# Altium schematic sheet Power.SchDoc
size A
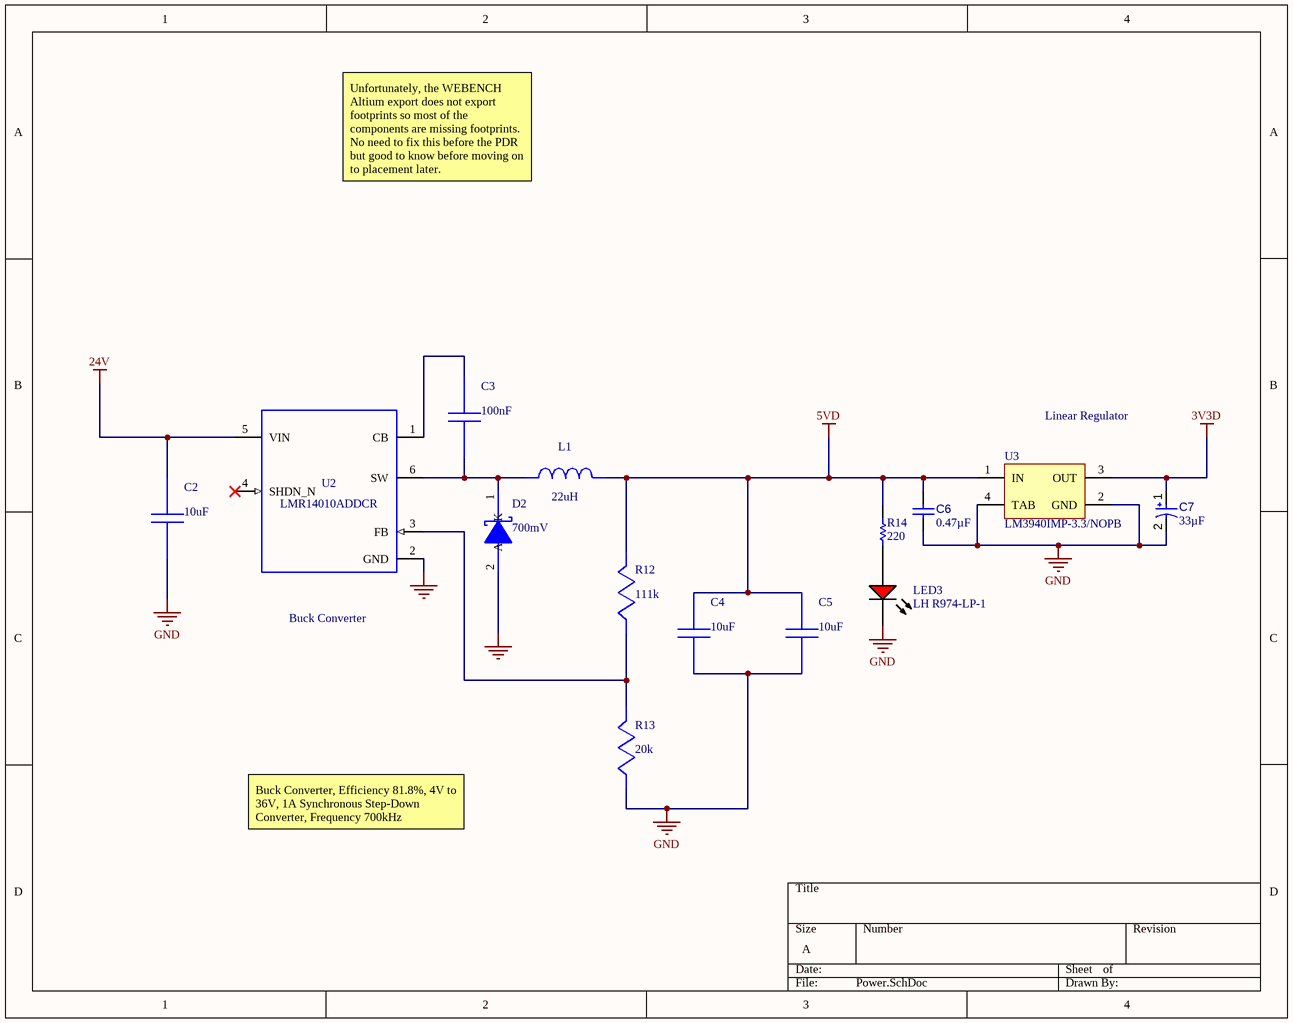
[diagram p0: Power.SchDoc]

## Parts
C2  value 10uF  (hidden comment: C3225X7R1H106M250AC)
C3  value 100nF  (hidden comment: C0805C104M5RACTU)
C4  value 10uF  (hidden comment: C3216X6S1V106K160AC)
C5  value 10uF  (hidden comment: C3216X6S1V106K160AC)
C6  0.47µF  [CAPC2013X145X50ML20T25]
C7  value 33µF  [KEMT-T491-D_M]  (hidden comment: T491D107K010AT)
D2  value 700mV  (hidden comment: SS26FL)
L1  value 22uH  (hidden comment: NPI105C220MTRF)
LED3  LH R974-LP-1  [0805_A]
R12  value 111k  (hidden comment: RT0805BRD07111KL)
R13  value 20k  (hidden comment: CRCW040220K0FKED)
R14  220  [RESC2013X50X35ML15T15]
U2  LMR14010ADDCR
U3  LM3940IMP-3.3/NOPB  [DCY0004A_M]

## Nets
0: D2.2(A) U2.2(GND)
3V3D: C7.1 U3.3(OUT)
5VD: C4.1 C5.1 C6.1 L1.2 R12.1 R14.1 U3.1(IN)
24V: C2.1 U2.5(VIN)
GND: C2.2 C4.2 C5.2 C6.2 C7.2 LED3.1(K) R13.2 U3.2(GND) U3.4(TAB)
NetC3_1: C3.1 U2.1(CB)
NetC3_2: C3.2 D2.1(K) L1.1 U2.6(SW)
NetLED3_2: LED3.2(A) R14.2
NetR12_2: R12.2 R13.1 U2.3(FB)

Not connected (* = marked no-connect by the designer): U2 4(SHDN_N)*

## Notes on the sheet
- Unfortunately, the WEBENCH Altium export does not export footprints so most of the components are missing footprints. No need to fix this before the PDR but good to know before moving on to placement later.
- Linear Regulator
- Buck Converter
- Buck Converter, Efficiency 81.8%, 4V to 36V, 1A Synchronous Step-Down Converter, Frequency 700kHz

## Library data of the parts
C2 = C3225X7R1H106M250AC: C3225X7R1H106M25; Manufacturer Name: TDK; PackageReference: C3225X7R1H106M250AC; Manufacturer Part Number: C3225X7R1H106M250AC
C3 = C0805C104M5RACTU: Manufacturer Name: Kemet; PackageReference: C0805C104M5RACTU; Manufacturer Part Number: C0805C104M5RACTU
C4 C5 = C3216X6S1V106K160AC: C3216X6S1V106K16; Manufacturer Name: TDK; PackageReference: C3216X6S1V106K160AC; Manufacturer Part Number: C3216X6S1V106K160AC
C6 = CMP-001-00010-4: Chip Capacitor, 1 uF, +/-10%, 25 V, 0805 (2012 Metric); Tolerance: 10%; Capacitor Type: Ceramic; Voltage Rating: 25V; Mounting Technology: SM; Case/Package: 0805; Max Operating Temperature: 125°C; RoHS Compliant: True; Value: 0.47µF; Min Operating Temperature: -55°C; Pins: 2
C7 = CMP-001-00037-5: Tantalum Surface Mount Capacitor-Standard Tantalum, 100 uF, +/- 10%, 10 V, -55 to 125 degC, 2917 (7343 Metric), RoHS, Tape and Reel; Manufacturer: Kemet; Ripple Current: 463mA; Voltage Rating: 10V; ESR: 700mohm; Manufacturer URL: http://www.kemet.com/; Case/Package: 2917; Tolerance: 10%; Datasheet URL: http://www.kemet.com/Lists/ProductCatalog/Attachments/254/KEM_T2005_T491.pdf; Packaging: TapeandReel; Pins: 2; Package Reference: T491-D; Package Description: 2-Pin Surface Mount Device, Body 7.3 x 4.3 mm; Min Operating Temperature: -55°C; Datasheet Version: Jun-16; Mounting Technology: SM; Package Quantity: 1; Capacitor Type: Tantalum; Max Operating Temperature: 125°C; RoHS Compliant: True
D2 = SS26FL: Manufacturer Name: Fairchild Semiconductor; PackageReference: SS26FL; Manufacturer Part Number: SS26FL
L1 = NPI105C220MTRF: Manufacturer Name: NIC Components; PackageReference: NPI105C220MTRF; Manufacturer Part Number: NPI105C220MTRF
LED3 = CMP-62016-000032-1: LED RED DIFFUSED 0805 SMD; Number of Elements: 1; Forward Voltage: 2.6V; Viewing Angle: 160°; Reverse Voltage: 5V; Test Current: 20mA; Dominant Wavelength: 645nm; Forward Current: 30mA; Luminous Intensity: 15mcd; Depth: 1.35mm; Min Operating Temperature: -30°C; Length: 2.1mm; Max Operating Temperature: 85°C; Radiation Hardening: No; Packaging: Tape and Reel; Number of Pins: 2; Mount: Surface Mount; Lens Style: Diffused
R12 = RT0805BRD07111KL: Manufacturer Name: Yageo; PackageReference: RT0805BRD07111KL; Manufacturer Part Number: RT0805BRD07111KL
R13 = CRCW040220K0FKED: Manufacturer Name: Vishay-Dale; PackageReference: CRCW040220K0FKED; Manufacturer Part Number: CRCW040220K0FKED
R14 = CMP-009-00001-4: Chip Resistor, 10k Ohm, +/- 1%, 125 mW, -55 to 155 degC, 0805 (2012 Metric); Value: 220
U2 = LMR14010ADDCR: Manufacturer Name: Texas Instruments; PackageReference: LMR14010ADDCR; Manufacturer Part Number: LMR14010ADDCR; Value: N/A
U3 = CMP-0062-01788-3: 1A Low Dropout Regulator for 5V to 3.3V Conversion, 4-pin SOT-223, Pb-Free; Manufacturer: Texas Instruments; PowerWise: N; CompType: LDO IC; PackageTopMarking: XYTT*L52B; PackageDescription: Molded SOT-223, 6.50 x 3.56 x 1.6mm Body, 4 Lead, 2.3mm Pitch; ComponentLink1URL: http://www.ti.com/general/docs/lit/getliterature.tsp?genericPartNumber=LM3940&fileType=pdf; PackageReference: DCY0004A; RoHS: Y; ComponentLink1Description: Datasheet URL; PinCount: 4; Code_JEDEC: TO-261-AA; Code_IPC: SOT223-4